# Altium schematic sheet FPGA_Port.SchDoc: LiveDesign Evaluation - Port Switcher
size A4; Organization: Altium Limited; Address1: L3, 12a Rodborough Rd; Address2: Frenchs Forest; Address3: NSW; Address4: Australia 2086; DocumentNumber: 5; SheetNumber: 5; SheetTotal: 5
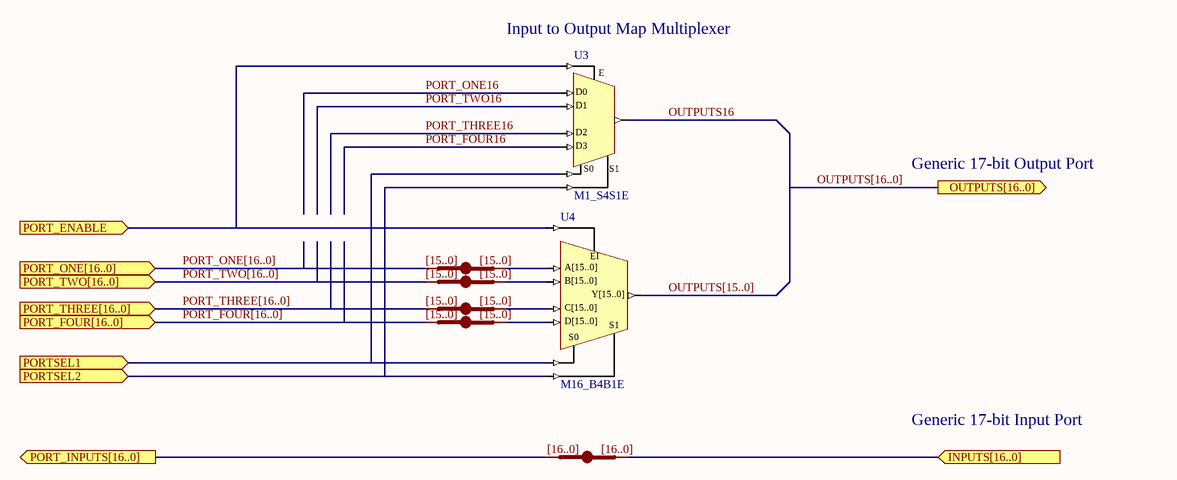
[diagram p0: FPGA_Port.SchDoc]

## Parts
JB_S1  IndexA: [16..0]  (hidden comment: JB)
JB_S2  IndexA: [15..0]  (hidden comment: JB)
JB_S3  IndexA: [15..0]  (hidden comment: JB)
JB_S4  IndexA: [15..0]  (hidden comment: JB)
JB_S5  IndexA: [15..0]  (hidden comment: JB)
U3  M1_S4S1E
U4  M16_B4B1E

## Ports
INPUTS[16..0] (in), OUTPUTS[16..0] (out), PORT_ENABLE (in), PORT_FOUR[16..0] (in), PORT_INPUTS[16..0] (out), PORT_ONE[16..0] (in), PORT_THREE[16..0] (in), PORT_TWO[16..0] (in), PORTSEL1 (in), PORTSEL2 (in)

## Nets
INPUTS[16..0]: JB_S1.B[0..0] ; port INPUTS[16..0]
OUTPUTS16: U3.O
OUTPUTS[15..0]: U4.Y[15..0]
PORT_ENABLE: U3.E U4.EI ; port PORT_ENABLE
PORT_FOUR16: U3.D3
PORT_FOUR[16..0]: JB_S5.A[0..0] ; port PORT_FOUR[16..0]
PORT_INPUTS[16..0]: JB_S1.A[0..0] ; port PORT_INPUTS[16..0]
PORT_ONE16: U3.D0
PORT_ONE[16..0]: JB_S2.A[0..0] ; port PORT_ONE[16..0]
PORT_THREE16: U3.D2
PORT_THREE[16..0]: JB_S4.A[0..0] ; port PORT_THREE[16..0]
PORT_TWO16: U3.D1
PORT_TWO[16..0]: JB_S3.A[0..0] ; port PORT_TWO[16..0]
PORTSEL1: U3.S0 U4.S0 ; port PORTSEL1
PORTSEL2: U3.S1 U4.S1 ; port PORTSEL2
NetJB_S2_B[0..0]: JB_S2.B[0..0] U4.A[15..0]
NetJB_S3_B[0..0]: JB_S3.B[0..0] U4.B[15..0]
NetJB_S4_B[0..0]: JB_S4.B[0..0] U4.C[15..0]
NetJB_S5_B[0..0]: JB_S5.B[0..0] U4.D[15..0]

## Buses and harness runs
bus OUTPUTS[15..0]
bus OUTPUTS[16..0] = port OUTPUTS[16..0]
bus PORT_FOUR[16..0] = port PORT_FOUR[16..0]
bus PORT_ONE[16..0] = port PORT_ONE[16..0]
bus PORT_THREE[16..0] = port PORT_THREE[16..0]
bus PORT_TWO[16..0] = port PORT_TWO[16..0]

## Notes on the sheet
- (near U3) Input to Output Map Multiplexer
- Generic 17-bit Output Port
- Generic 17-bit Input Port
- Title
- Size:
- Date:
- A4
- Number:
- Time:
- Revision:
- Sheet
- of
- File:

## Library data of the parts
JB_S1-JB_S5 = JB: System BUS Joiner; Published: 29-Jan-2004; Publisher: Altium Limited; Core Revision: 1.00.00
  JB_S1: IndexB: [16..0]
  JB_S2-JB_S5: IndexB: [15..0]
U3 = M1_S4S1E: 4x1-Single Wire to 1x1-Single Wire Multiplexer With Enable; Xilinx Equivalent: M4_1E; ArchiveName: GENERIC; VHDLIB_SIM: GENERIC_LIB; Published: 29-Jan-2004; Publisher: Altium Limited; Core Revision: 1.00.00
U4 = M16_B4B1E: 4x16-Bit Bus to 1x16-Bit Bus Multiplexer With Enable; ArchiveName: GENERIC; VHDLIB_SIM: GENERIC_LIB; Published: 29-Jan-2004; Publisher: Altium Limited; Core Revision: 1.00.00